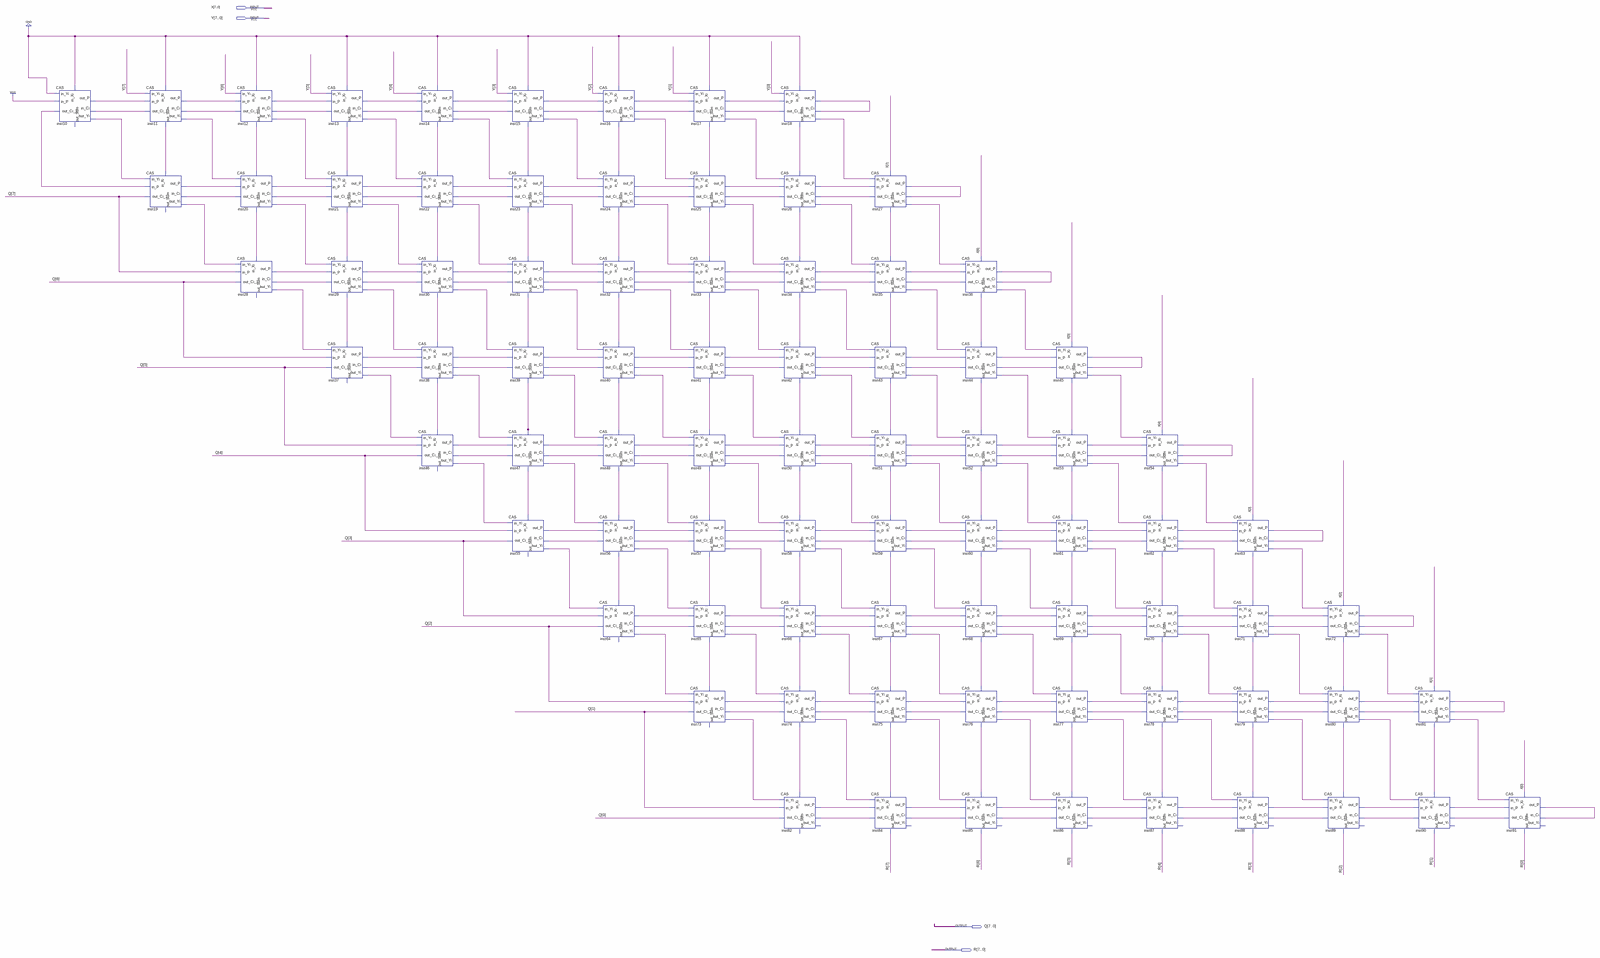
[diagram p0: schematic sheet, whole]
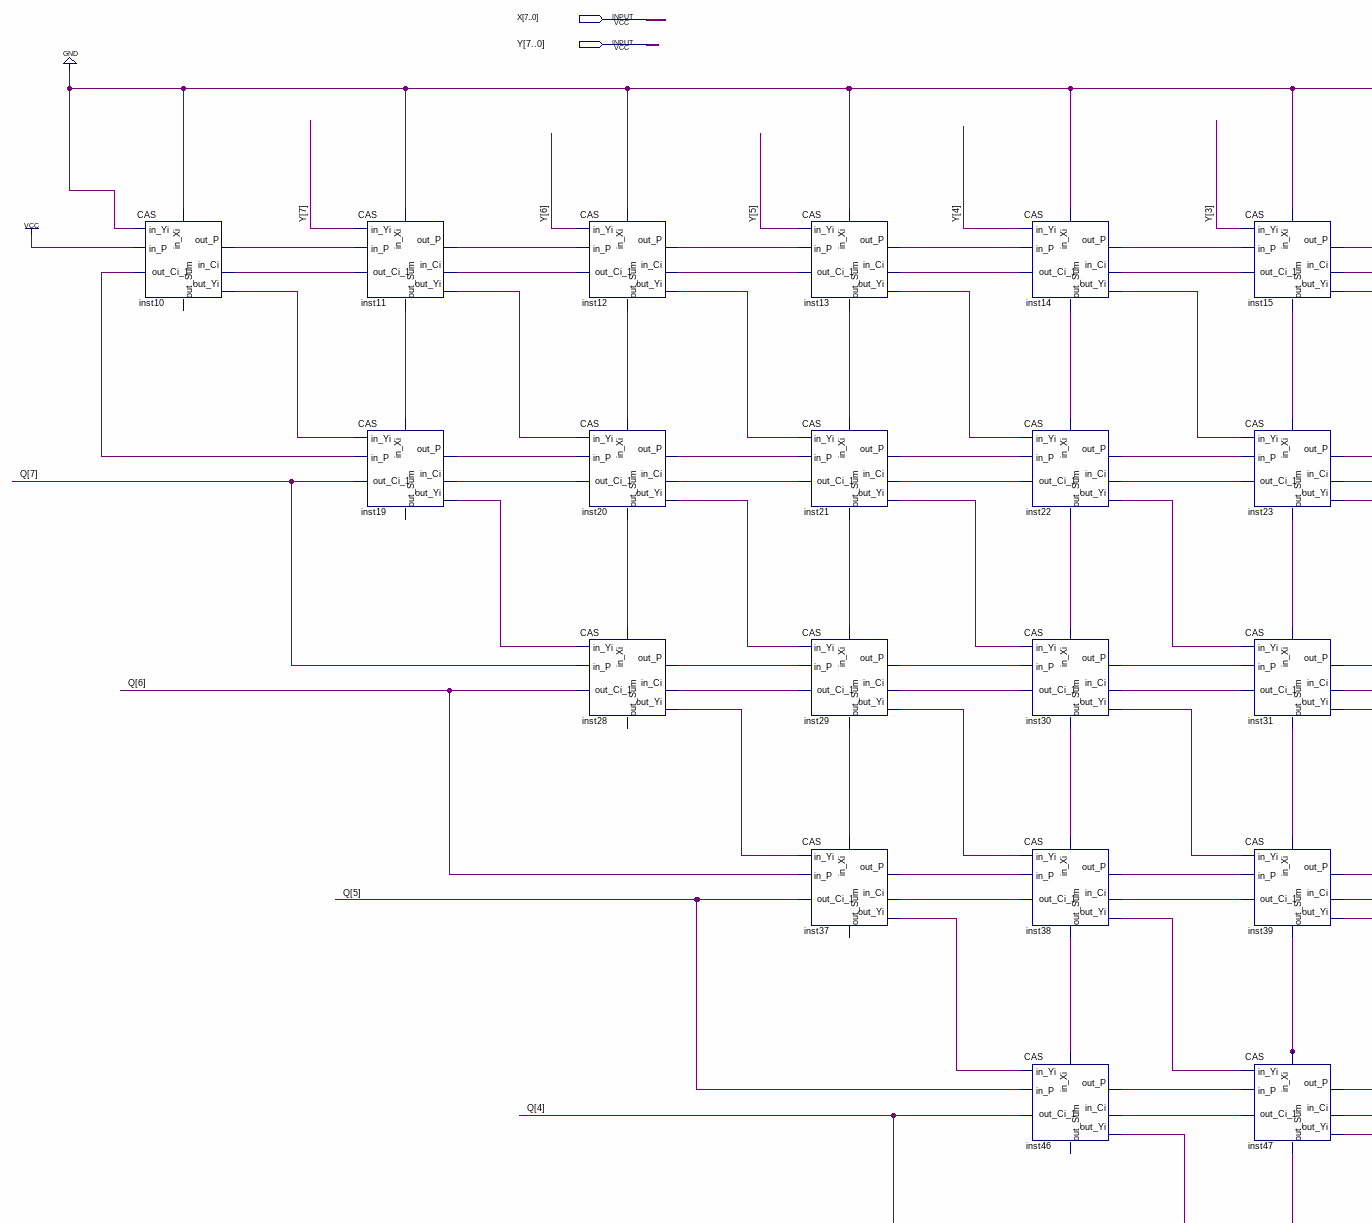
[diagram p1: schematic sheet, upper left part]
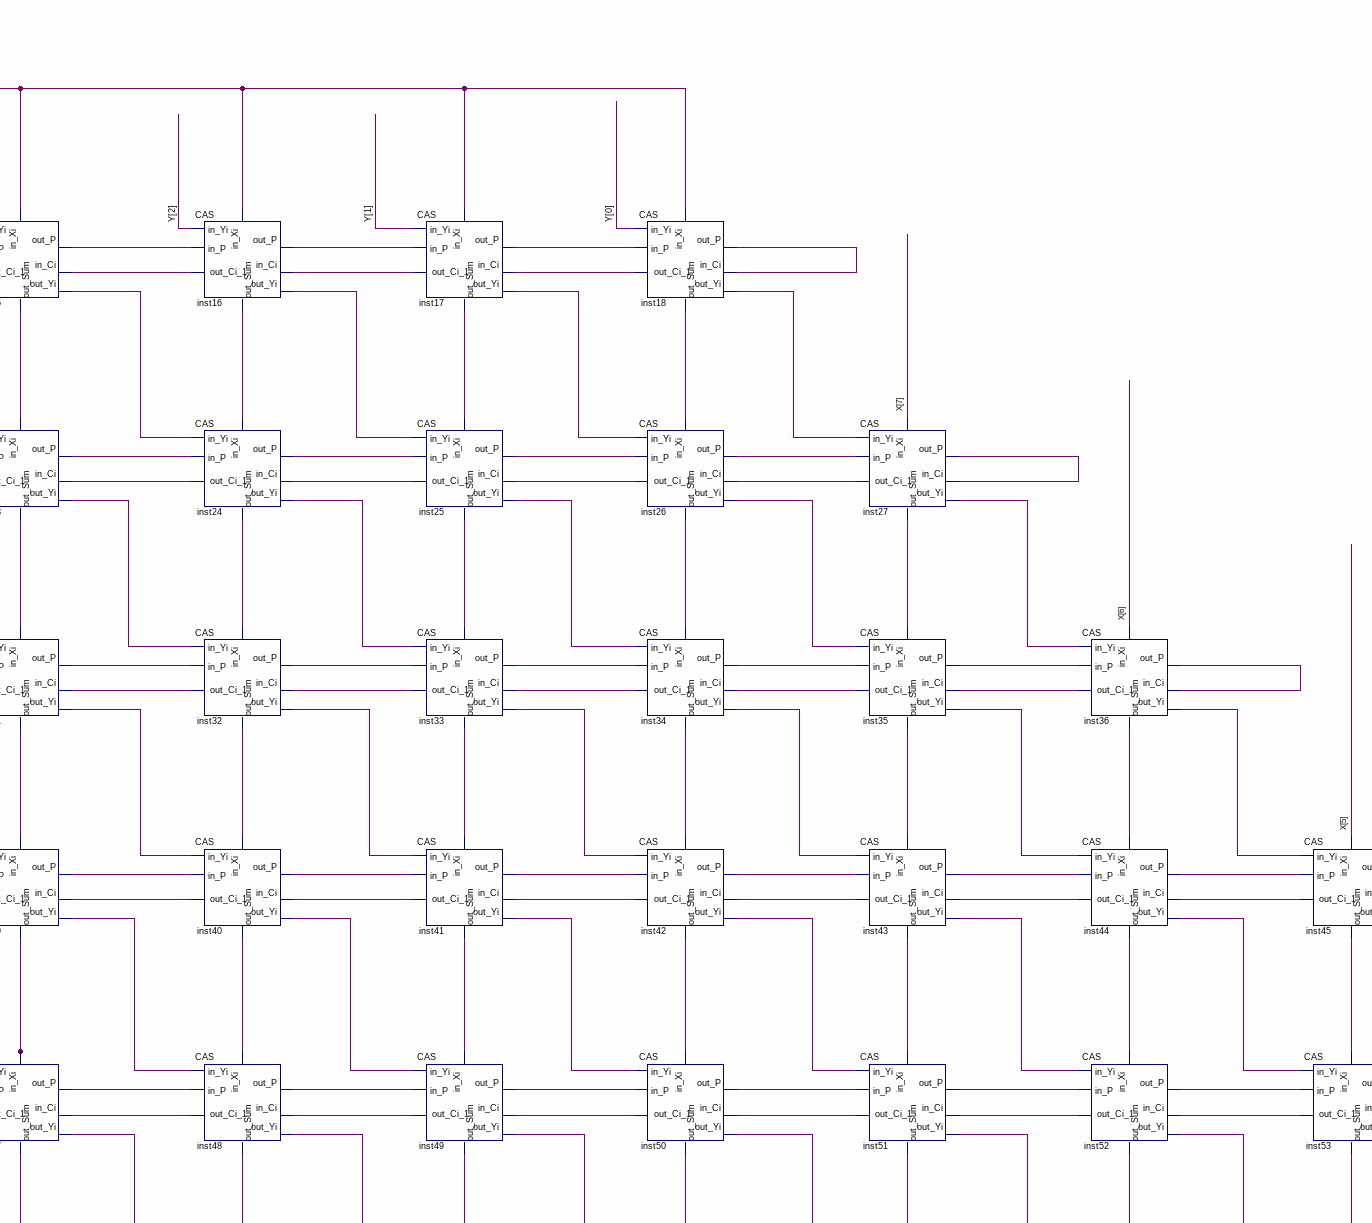
[diagram p2: schematic sheet, upper centre part]
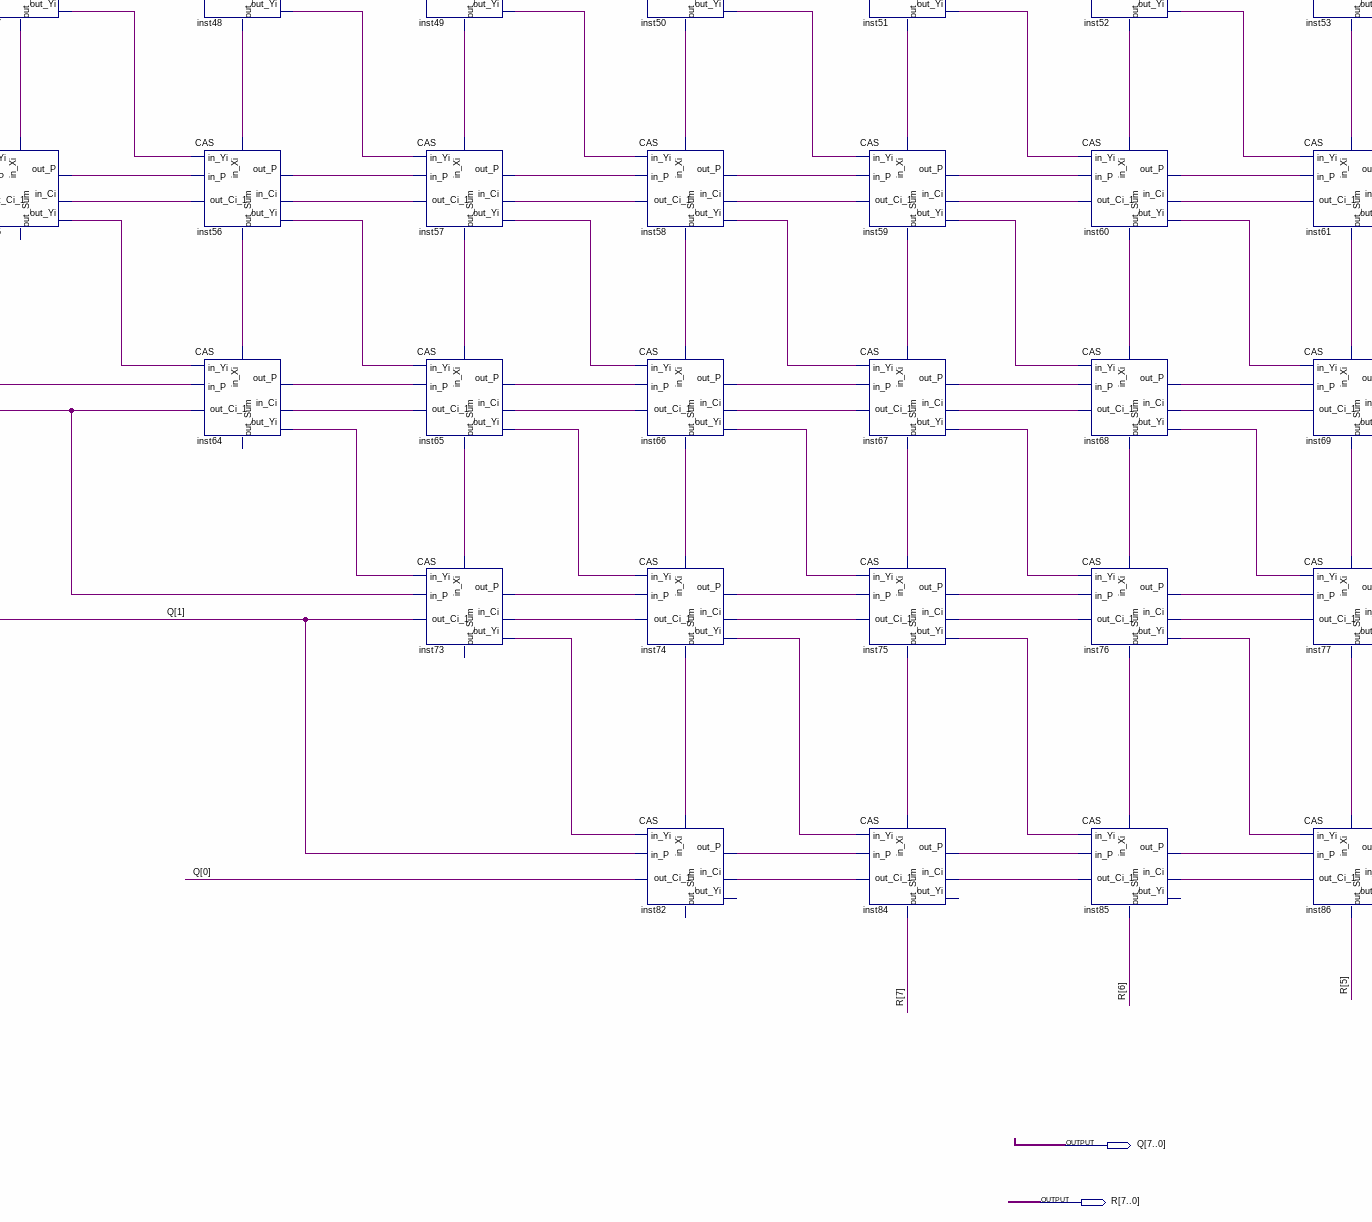
[diagram p3: schematic sheet, lower centre part]
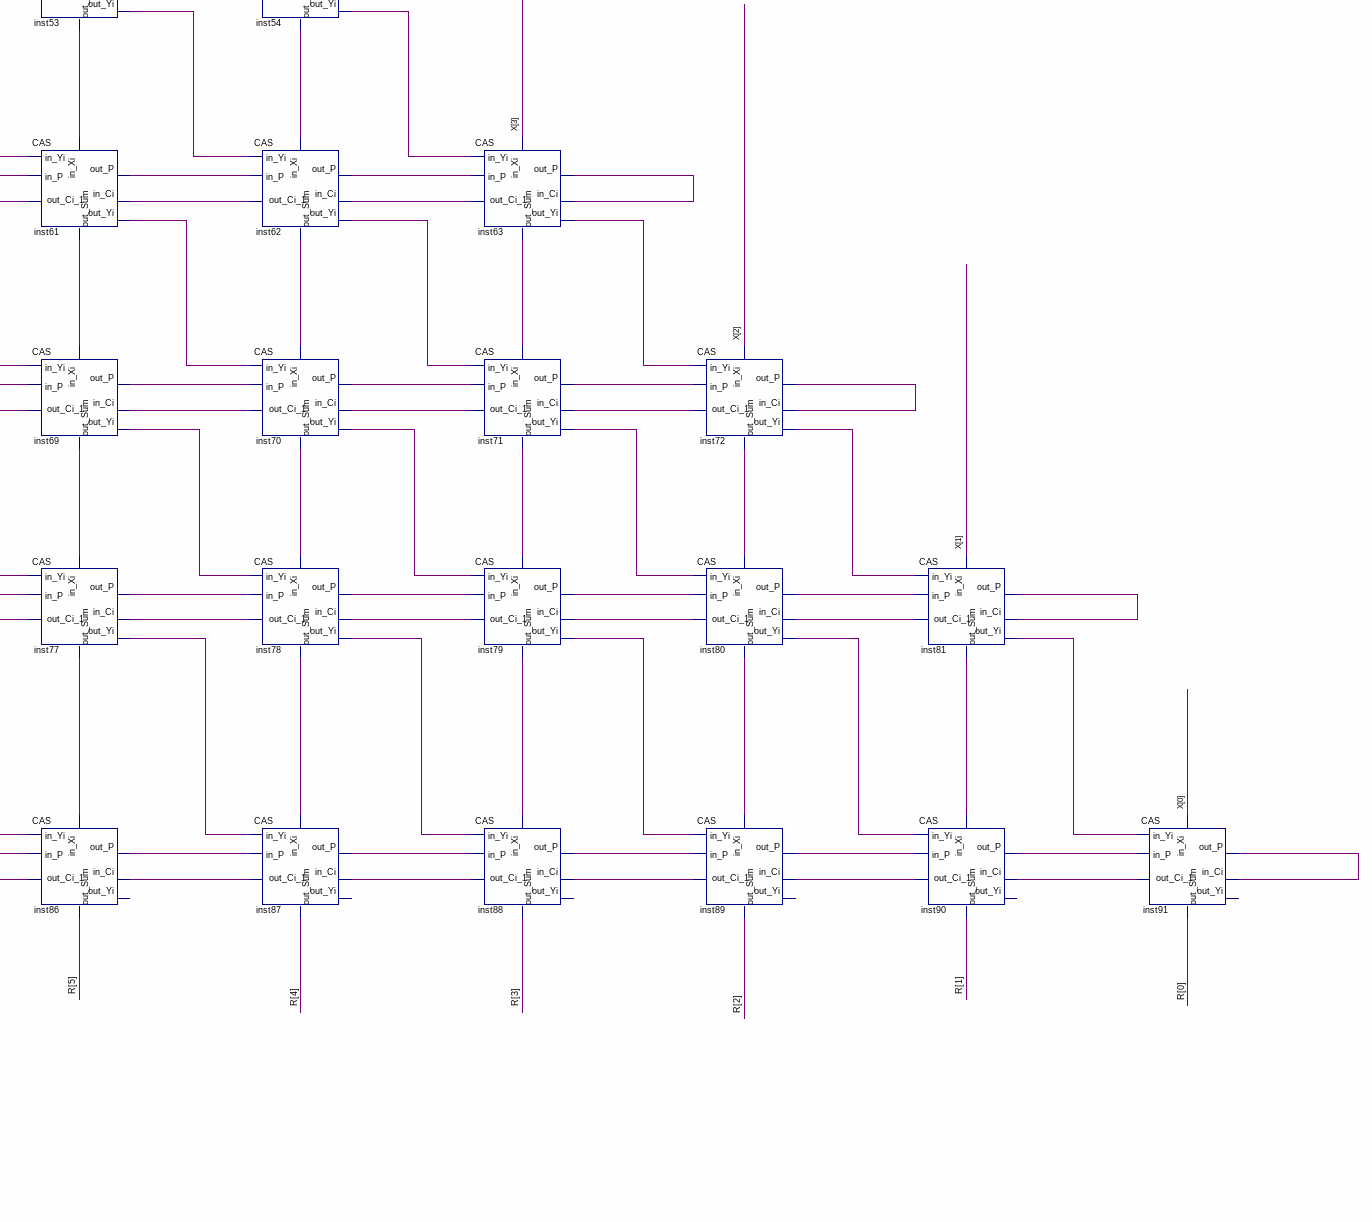
[diagram p4: schematic sheet, lower right part]
// Quartus schematic div8.bdf as structural Verilog: 81 symbols, 4 pins
module div8 (
  input  [7:0] X,
  input  [7:0] Y,
  output [7:0] Q,
  output [7:0] R
);

  wire inst10_out_ci_1, inst10_out_p, inst10_out_yi, inst11_out_ci_1, inst11_out_p, inst11_out_sum,
       inst11_out_yi, inst12_out_ci_1, inst12_out_p, inst12_out_sum, inst12_out_yi, inst13_out_ci_1,
       inst13_out_p, inst13_out_sum, inst13_out_yi, inst14_out_ci_1, inst14_out_p, inst14_out_sum,
       inst14_out_yi, inst15_out_ci_1, inst15_out_p, inst15_out_sum, inst15_out_yi, inst16_out_ci_1,
       inst16_out_p, inst16_out_sum, inst16_out_yi, inst17_out_ci_1, inst17_out_p, inst17_out_sum,
       inst17_out_yi, inst18_out_ci_1, inst18_out_p, inst18_out_sum, inst18_out_yi, inst19_out_p,
       inst19_out_yi, inst20_out_ci_1, inst20_out_p, inst20_out_sum, inst20_out_yi, inst21_out_ci_1,
       inst21_out_p, inst21_out_sum, inst21_out_yi, inst22_out_ci_1, inst22_out_p, inst22_out_sum,
       inst22_out_yi, inst23_out_ci_1, inst23_out_p, inst23_out_sum, inst23_out_yi, inst24_out_ci_1,
       inst24_out_p, inst24_out_sum, inst24_out_yi, inst25_out_ci_1, inst25_out_p, inst25_out_sum,
       inst25_out_yi, inst26_out_ci_1, inst26_out_p, inst26_out_sum, inst26_out_yi, inst27_out_ci_1,
       inst27_out_p, inst27_out_sum, inst27_out_yi, inst28_out_p, inst28_out_yi, inst29_out_ci_1,
       inst29_out_p, inst29_out_sum, inst29_out_yi, inst30_out_ci_1, inst30_out_p, inst30_out_sum,
       inst30_out_yi, inst31_out_ci_1, inst31_out_p, inst31_out_sum, inst31_out_yi, inst32_out_ci_1,
       inst32_out_p, inst32_out_sum, inst32_out_yi, inst33_out_ci_1, inst33_out_p, inst33_out_sum,
       inst33_out_yi, inst34_out_ci_1, inst34_out_p, inst34_out_sum, inst34_out_yi, inst35_out_ci_1,
       inst35_out_p, inst35_out_sum, inst35_out_yi, inst36_out_ci_1, inst36_out_p, inst36_out_sum,
       inst36_out_yi, inst37_out_p, inst37_out_yi, inst38_out_ci_1, inst38_out_p, inst38_out_sum,
       inst38_out_yi, inst39_out_ci_1, inst39_out_p, inst39_out_sum, inst39_out_yi, inst40_out_ci_1,
       inst40_out_p, inst40_out_sum, inst40_out_yi, inst41_out_ci_1, inst41_out_p, inst41_out_sum,
       inst41_out_yi, inst42_out_ci_1, inst42_out_p, inst42_out_sum, inst42_out_yi, inst43_out_ci_1,
       inst43_out_p, inst43_out_sum, inst43_out_yi, inst44_out_ci_1, inst44_out_p, inst44_out_sum,
       inst44_out_yi, inst45_out_ci_1, inst45_out_p, inst45_out_sum, inst45_out_yi, inst46_out_p,
       inst46_out_yi, inst47_out_ci_1, inst47_out_p, inst47_out_sum, inst47_out_yi, inst48_out_ci_1,
       inst48_out_p, inst48_out_sum, inst48_out_yi, inst49_out_ci_1, inst49_out_p, inst49_out_sum,
       inst49_out_yi, inst50_out_ci_1, inst50_out_p, inst50_out_sum, inst50_out_yi, inst51_out_ci_1,
       inst51_out_p, inst51_out_sum, inst51_out_yi, inst52_out_ci_1, inst52_out_p, inst52_out_sum,
       inst52_out_yi, inst53_out_ci_1, inst53_out_p, inst53_out_sum, inst53_out_yi, inst54_out_ci_1,
       inst54_out_p, inst54_out_sum, inst54_out_yi, inst55_out_p, inst55_out_yi, inst56_out_ci_1,
       inst56_out_p, inst56_out_sum, inst56_out_yi, inst57_out_ci_1, inst57_out_p, inst57_out_sum,
       inst57_out_yi, inst58_out_ci_1, inst58_out_p, inst58_out_sum, inst58_out_yi, inst59_out_ci_1,
       inst59_out_p, inst59_out_sum, inst59_out_yi, inst60_out_ci_1, inst60_out_p, inst60_out_sum,
       inst60_out_yi, inst61_out_ci_1, inst61_out_p, inst61_out_sum, inst61_out_yi, inst62_out_ci_1,
       inst62_out_p, inst62_out_sum, inst62_out_yi, inst63_out_ci_1, inst63_out_p, inst63_out_sum,
       inst63_out_yi, inst64_out_p, inst64_out_yi, inst65_out_ci_1, inst65_out_p, inst65_out_sum,
       inst65_out_yi, inst66_out_ci_1, inst66_out_p, inst66_out_sum, inst66_out_yi, inst67_out_ci_1,
       inst67_out_p, inst67_out_sum, inst67_out_yi, inst68_out_ci_1, inst68_out_p, inst68_out_sum,
       inst68_out_yi, inst69_out_ci_1, inst69_out_p, inst69_out_sum, inst69_out_yi, inst70_out_ci_1,
       inst70_out_p, inst70_out_sum, inst70_out_yi, inst71_out_ci_1, inst71_out_p, inst71_out_sum,
       inst71_out_yi, inst72_out_ci_1, inst72_out_p, inst72_out_sum, inst72_out_yi, inst73_out_p,
       inst73_out_yi, inst74_out_ci_1, inst74_out_p, inst74_out_sum, inst74_out_yi, inst75_out_ci_1,
       inst75_out_p, inst75_out_sum, inst75_out_yi, inst76_out_ci_1, inst76_out_p, inst76_out_sum,
       inst76_out_yi, inst77_out_ci_1, inst77_out_p, inst77_out_sum, inst77_out_yi, inst78_out_ci_1,
       inst78_out_p, inst78_out_sum, inst78_out_yi, inst79_out_ci_1, inst79_out_p, inst79_out_sum,
       inst79_out_yi, inst80_out_ci_1, inst80_out_p, inst80_out_sum, inst80_out_yi, inst81_out_ci_1,
       inst81_out_p, inst81_out_sum, inst81_out_yi, inst82_out_p, inst84_out_ci_1, inst84_out_p,
       inst85_out_ci_1, inst85_out_p, inst86_out_ci_1, inst86_out_p, inst87_out_ci_1, inst87_out_p,
       inst88_out_ci_1, inst88_out_p, inst89_out_ci_1, inst89_out_p, inst90_out_ci_1, inst90_out_p,
       inst91_out_ci_1, inst91_out_p;

  CAS inst10 (
    .in_Xi(1'b0), .in_Yi(1'b0), .in_P(1'b1), .in_Ci(inst11_out_ci_1), .out_P(inst10_out_p),
    .out_Yi(inst10_out_yi), .out_Ci_1(inst10_out_ci_1));  // open: out_Sum
  CAS inst11 (
    .in_Xi(1'b0), .in_Yi(Y[7]), .in_P(inst10_out_p), .in_Ci(inst12_out_ci_1), .out_P(inst11_out_p),
    .out_Yi(inst11_out_yi), .out_Sum(inst11_out_sum), .out_Ci_1(inst11_out_ci_1));
  CAS inst19 (
    .in_Xi(inst11_out_sum), .in_Yi(inst10_out_yi), .in_P(inst10_out_ci_1), .in_Ci(inst20_out_ci_1),
    .out_P(inst19_out_p), .out_Yi(inst19_out_yi), .out_Ci_1(Q[7]));  // open: out_Sum
  CAS inst12 (
    .in_Xi(1'b0), .in_Yi(Y[6]), .in_P(inst11_out_p), .in_Ci(inst13_out_ci_1), .out_P(inst12_out_p),
    .out_Yi(inst12_out_yi), .out_Sum(inst12_out_sum), .out_Ci_1(inst12_out_ci_1));
  CAS inst20 (
    .in_Xi(inst12_out_sum), .in_Yi(inst11_out_yi), .in_P(inst19_out_p), .in_Ci(inst21_out_ci_1),
    .out_P(inst20_out_p), .out_Yi(inst20_out_yi), .out_Sum(inst20_out_sum), .out_Ci_1(inst20_out_ci_1));
  CAS inst28 (
    .in_Xi(inst20_out_sum), .in_Yi(inst19_out_yi), .in_P(Q[7]), .in_Ci(inst29_out_ci_1),
    .out_P(inst28_out_p), .out_Yi(inst28_out_yi), .out_Ci_1(Q[6]));  // open: out_Sum
  CAS inst13 (
    .in_Xi(1'b0), .in_Yi(Y[5]), .in_P(inst12_out_p), .in_Ci(inst14_out_ci_1), .out_P(inst13_out_p),
    .out_Yi(inst13_out_yi), .out_Sum(inst13_out_sum), .out_Ci_1(inst13_out_ci_1));
  CAS inst21 (
    .in_Xi(inst13_out_sum), .in_Yi(inst12_out_yi), .in_P(inst20_out_p), .in_Ci(inst22_out_ci_1),
    .out_P(inst21_out_p), .out_Yi(inst21_out_yi), .out_Sum(inst21_out_sum), .out_Ci_1(inst21_out_ci_1));
  CAS inst29 (
    .in_Xi(inst21_out_sum), .in_Yi(inst20_out_yi), .in_P(inst28_out_p), .in_Ci(inst30_out_ci_1),
    .out_P(inst29_out_p), .out_Yi(inst29_out_yi), .out_Sum(inst29_out_sum), .out_Ci_1(inst29_out_ci_1));
  CAS inst37 (
    .in_Xi(inst29_out_sum), .in_Yi(inst28_out_yi), .in_P(Q[6]), .in_Ci(inst38_out_ci_1),
    .out_P(inst37_out_p), .out_Yi(inst37_out_yi), .out_Ci_1(Q[5]));  // open: out_Sum
  CAS inst14 (
    .in_Xi(1'b0), .in_Yi(Y[4]), .in_P(inst13_out_p), .in_Ci(inst15_out_ci_1), .out_P(inst14_out_p),
    .out_Yi(inst14_out_yi), .out_Sum(inst14_out_sum), .out_Ci_1(inst14_out_ci_1));
  CAS inst22 (
    .in_Xi(inst14_out_sum), .in_Yi(inst13_out_yi), .in_P(inst21_out_p), .in_Ci(inst23_out_ci_1),
    .out_P(inst22_out_p), .out_Yi(inst22_out_yi), .out_Sum(inst22_out_sum), .out_Ci_1(inst22_out_ci_1));
  CAS inst30 (
    .in_Xi(inst22_out_sum), .in_Yi(inst21_out_yi), .in_P(inst29_out_p), .in_Ci(inst31_out_ci_1),
    .out_P(inst30_out_p), .out_Yi(inst30_out_yi), .out_Sum(inst30_out_sum), .out_Ci_1(inst30_out_ci_1));
  CAS inst38 (
    .in_Xi(inst30_out_sum), .in_Yi(inst29_out_yi), .in_P(inst37_out_p), .in_Ci(inst39_out_ci_1),
    .out_P(inst38_out_p), .out_Yi(inst38_out_yi), .out_Sum(inst38_out_sum), .out_Ci_1(inst38_out_ci_1));
  CAS inst46 (
    .in_Xi(inst38_out_sum), .in_Yi(inst37_out_yi), .in_P(Q[5]), .in_Ci(inst47_out_ci_1),
    .out_P(inst46_out_p), .out_Yi(inst46_out_yi), .out_Ci_1(Q[4]));  // open: out_Sum
  CAS inst15 (
    .in_Xi(1'b0), .in_Yi(Y[3]), .in_P(inst14_out_p), .in_Ci(inst16_out_ci_1), .out_P(inst15_out_p),
    .out_Yi(inst15_out_yi), .out_Sum(inst15_out_sum), .out_Ci_1(inst15_out_ci_1));
  CAS inst23 (
    .in_Xi(inst15_out_sum), .in_Yi(inst14_out_yi), .in_P(inst22_out_p), .in_Ci(inst24_out_ci_1),
    .out_P(inst23_out_p), .out_Yi(inst23_out_yi), .out_Sum(inst23_out_sum), .out_Ci_1(inst23_out_ci_1));
  CAS inst31 (
    .in_Xi(inst23_out_sum), .in_Yi(inst22_out_yi), .in_P(inst30_out_p), .in_Ci(inst32_out_ci_1),
    .out_P(inst31_out_p), .out_Yi(inst31_out_yi), .out_Sum(inst31_out_sum), .out_Ci_1(inst31_out_ci_1));
  CAS inst39 (
    .in_Xi(inst31_out_sum), .in_Yi(inst30_out_yi), .in_P(inst38_out_p), .in_Ci(inst40_out_ci_1),
    .out_P(inst39_out_p), .out_Yi(inst39_out_yi), .out_Sum(inst39_out_sum), .out_Ci_1(inst39_out_ci_1));
  CAS inst47 (
    .in_Xi(inst39_out_sum), .in_Yi(inst38_out_yi), .in_P(inst46_out_p), .in_Ci(inst48_out_ci_1),
    .out_P(inst47_out_p), .out_Yi(inst47_out_yi), .out_Sum(inst47_out_sum), .out_Ci_1(inst47_out_ci_1));
  CAS inst55 (
    .in_Xi(inst47_out_sum), .in_Yi(inst46_out_yi), .in_P(Q[4]), .in_Ci(inst56_out_ci_1),
    .out_P(inst55_out_p), .out_Yi(inst55_out_yi), .out_Ci_1(Q[3]));  // open: out_Sum
  CAS inst16 (
    .in_Xi(1'b0), .in_Yi(Y[2]), .in_P(inst15_out_p), .in_Ci(inst17_out_ci_1), .out_P(inst16_out_p),
    .out_Yi(inst16_out_yi), .out_Sum(inst16_out_sum), .out_Ci_1(inst16_out_ci_1));
  CAS inst24 (
    .in_Xi(inst16_out_sum), .in_Yi(inst15_out_yi), .in_P(inst23_out_p), .in_Ci(inst25_out_ci_1),
    .out_P(inst24_out_p), .out_Yi(inst24_out_yi), .out_Sum(inst24_out_sum), .out_Ci_1(inst24_out_ci_1));
  CAS inst32 (
    .in_Xi(inst24_out_sum), .in_Yi(inst23_out_yi), .in_P(inst31_out_p), .in_Ci(inst33_out_ci_1),
    .out_P(inst32_out_p), .out_Yi(inst32_out_yi), .out_Sum(inst32_out_sum), .out_Ci_1(inst32_out_ci_1));
  CAS inst40 (
    .in_Xi(inst32_out_sum), .in_Yi(inst31_out_yi), .in_P(inst39_out_p), .in_Ci(inst41_out_ci_1),
    .out_P(inst40_out_p), .out_Yi(inst40_out_yi), .out_Sum(inst40_out_sum), .out_Ci_1(inst40_out_ci_1));
  CAS inst48 (
    .in_Xi(inst40_out_sum), .in_Yi(inst39_out_yi), .in_P(inst47_out_p), .in_Ci(inst49_out_ci_1),
    .out_P(inst48_out_p), .out_Yi(inst48_out_yi), .out_Sum(inst48_out_sum), .out_Ci_1(inst48_out_ci_1));
  CAS inst56 (
    .in_Xi(inst48_out_sum), .in_Yi(inst47_out_yi), .in_P(inst55_out_p), .in_Ci(inst57_out_ci_1),
    .out_P(inst56_out_p), .out_Yi(inst56_out_yi), .out_Sum(inst56_out_sum), .out_Ci_1(inst56_out_ci_1));
  CAS inst64 (
    .in_Xi(inst56_out_sum), .in_Yi(inst55_out_yi), .in_P(Q[3]), .in_Ci(inst65_out_ci_1),
    .out_P(inst64_out_p), .out_Yi(inst64_out_yi), .out_Ci_1(Q[2]));  // open: out_Sum
  CAS inst17 (
    .in_Xi(1'b0), .in_Yi(Y[1]), .in_P(inst16_out_p), .in_Ci(inst18_out_ci_1), .out_P(inst17_out_p),
    .out_Yi(inst17_out_yi), .out_Sum(inst17_out_sum), .out_Ci_1(inst17_out_ci_1));
  CAS inst25 (
    .in_Xi(inst17_out_sum), .in_Yi(inst16_out_yi), .in_P(inst24_out_p), .in_Ci(inst26_out_ci_1),
    .out_P(inst25_out_p), .out_Yi(inst25_out_yi), .out_Sum(inst25_out_sum), .out_Ci_1(inst25_out_ci_1));
  CAS inst33 (
    .in_Xi(inst25_out_sum), .in_Yi(inst24_out_yi), .in_P(inst32_out_p), .in_Ci(inst34_out_ci_1),
    .out_P(inst33_out_p), .out_Yi(inst33_out_yi), .out_Sum(inst33_out_sum), .out_Ci_1(inst33_out_ci_1));
  CAS inst41 (
    .in_Xi(inst33_out_sum), .in_Yi(inst32_out_yi), .in_P(inst40_out_p), .in_Ci(inst42_out_ci_1),
    .out_P(inst41_out_p), .out_Yi(inst41_out_yi), .out_Sum(inst41_out_sum), .out_Ci_1(inst41_out_ci_1));
  CAS inst49 (
    .in_Xi(inst41_out_sum), .in_Yi(inst40_out_yi), .in_P(inst48_out_p), .in_Ci(inst50_out_ci_1),
    .out_P(inst49_out_p), .out_Yi(inst49_out_yi), .out_Sum(inst49_out_sum), .out_Ci_1(inst49_out_ci_1));
  CAS inst57 (
    .in_Xi(inst49_out_sum), .in_Yi(inst48_out_yi), .in_P(inst56_out_p), .in_Ci(inst58_out_ci_1),
    .out_P(inst57_out_p), .out_Yi(inst57_out_yi), .out_Sum(inst57_out_sum), .out_Ci_1(inst57_out_ci_1));
  CAS inst65 (
    .in_Xi(inst57_out_sum), .in_Yi(inst56_out_yi), .in_P(inst64_out_p), .in_Ci(inst66_out_ci_1),
    .out_P(inst65_out_p), .out_Yi(inst65_out_yi), .out_Sum(inst65_out_sum), .out_Ci_1(inst65_out_ci_1));
  CAS inst73 (
    .in_Xi(inst65_out_sum), .in_Yi(inst64_out_yi), .in_P(Q[2]), .in_Ci(inst74_out_ci_1),
    .out_P(inst73_out_p), .out_Yi(inst73_out_yi), .out_Ci_1(Q[1]));  // open: out_Sum
  CAS inst18 (
    .in_Xi(1'b0), .in_Yi(Y[0]), .in_P(inst17_out_p), .in_Ci(inst18_out_p), .out_P(inst18_out_p),
    .out_Yi(inst18_out_yi), .out_Sum(inst18_out_sum), .out_Ci_1(inst18_out_ci_1));
  CAS inst26 (
    .in_Xi(inst18_out_sum), .in_Yi(inst17_out_yi), .in_P(inst25_out_p), .in_Ci(inst27_out_ci_1),
    .out_P(inst26_out_p), .out_Yi(inst26_out_yi), .out_Sum(inst26_out_sum), .out_Ci_1(inst26_out_ci_1));
  CAS inst34 (
    .in_Xi(inst26_out_sum), .in_Yi(inst25_out_yi), .in_P(inst33_out_p), .in_Ci(inst35_out_ci_1),
    .out_P(inst34_out_p), .out_Yi(inst34_out_yi), .out_Sum(inst34_out_sum), .out_Ci_1(inst34_out_ci_1));
  CAS inst42 (
    .in_Xi(inst34_out_sum), .in_Yi(inst33_out_yi), .in_P(inst41_out_p), .in_Ci(inst43_out_ci_1),
    .out_P(inst42_out_p), .out_Yi(inst42_out_yi), .out_Sum(inst42_out_sum), .out_Ci_1(inst42_out_ci_1));
  CAS inst50 (
    .in_Xi(inst42_out_sum), .in_Yi(inst41_out_yi), .in_P(inst49_out_p), .in_Ci(inst51_out_ci_1),
    .out_P(inst50_out_p), .out_Yi(inst50_out_yi), .out_Sum(inst50_out_sum), .out_Ci_1(inst50_out_ci_1));
  CAS inst58 (
    .in_Xi(inst50_out_sum), .in_Yi(inst49_out_yi), .in_P(inst57_out_p), .in_Ci(inst59_out_ci_1),
    .out_P(inst58_out_p), .out_Yi(inst58_out_yi), .out_Sum(inst58_out_sum), .out_Ci_1(inst58_out_ci_1));
  CAS inst66 (
    .in_Xi(inst58_out_sum), .in_Yi(inst57_out_yi), .in_P(inst65_out_p), .in_Ci(inst67_out_ci_1),
    .out_P(inst66_out_p), .out_Yi(inst66_out_yi), .out_Sum(inst66_out_sum), .out_Ci_1(inst66_out_ci_1));
  CAS inst74 (
    .in_Xi(inst66_out_sum), .in_Yi(inst65_out_yi), .in_P(inst73_out_p), .in_Ci(inst75_out_ci_1),
    .out_P(inst74_out_p), .out_Yi(inst74_out_yi), .out_Sum(inst74_out_sum), .out_Ci_1(inst74_out_ci_1));
  CAS inst82 (
    .in_Xi(inst74_out_sum), .in_Yi(inst73_out_yi), .in_P(Q[1]), .in_Ci(inst84_out_ci_1),
    .out_P(inst82_out_p), .out_Ci_1(Q[0]));  // open: out_Yi, out_Sum
  CAS inst27 (
    .in_Xi(X[7]), .in_Yi(inst18_out_yi), .in_P(inst26_out_p), .in_Ci(inst27_out_p), .out_P(inst27_out_p),
    .out_Yi(inst27_out_yi), .out_Sum(inst27_out_sum), .out_Ci_1(inst27_out_ci_1));
  CAS inst35 (
    .in_Xi(inst27_out_sum), .in_Yi(inst26_out_yi), .in_P(inst34_out_p), .in_Ci(inst36_out_ci_1),
    .out_P(inst35_out_p), .out_Yi(inst35_out_yi), .out_Sum(inst35_out_sum), .out_Ci_1(inst35_out_ci_1));
  CAS inst43 (
    .in_Xi(inst35_out_sum), .in_Yi(inst34_out_yi), .in_P(inst42_out_p), .in_Ci(inst44_out_ci_1),
    .out_P(inst43_out_p), .out_Yi(inst43_out_yi), .out_Sum(inst43_out_sum), .out_Ci_1(inst43_out_ci_1));
  CAS inst51 (
    .in_Xi(inst43_out_sum), .in_Yi(inst42_out_yi), .in_P(inst50_out_p), .in_Ci(inst52_out_ci_1),
    .out_P(inst51_out_p), .out_Yi(inst51_out_yi), .out_Sum(inst51_out_sum), .out_Ci_1(inst51_out_ci_1));
  CAS inst59 (
    .in_Xi(inst51_out_sum), .in_Yi(inst50_out_yi), .in_P(inst58_out_p), .in_Ci(inst60_out_ci_1),
    .out_P(inst59_out_p), .out_Yi(inst59_out_yi), .out_Sum(inst59_out_sum), .out_Ci_1(inst59_out_ci_1));
  CAS inst67 (
    .in_Xi(inst59_out_sum), .in_Yi(inst58_out_yi), .in_P(inst66_out_p), .in_Ci(inst68_out_ci_1),
    .out_P(inst67_out_p), .out_Yi(inst67_out_yi), .out_Sum(inst67_out_sum), .out_Ci_1(inst67_out_ci_1));
  CAS inst75 (
    .in_Xi(inst67_out_sum), .in_Yi(inst66_out_yi), .in_P(inst74_out_p), .in_Ci(inst76_out_ci_1),
    .out_P(inst75_out_p), .out_Yi(inst75_out_yi), .out_Sum(inst75_out_sum), .out_Ci_1(inst75_out_ci_1));
  CAS inst84 (
    .in_Xi(inst75_out_sum), .in_Yi(inst74_out_yi), .in_P(inst82_out_p), .in_Ci(inst85_out_ci_1),
    .out_P(inst84_out_p), .out_Sum(R[7]), .out_Ci_1(inst84_out_ci_1));  // open: out_Yi
  CAS inst36 (
    .in_Xi(X[6]), .in_Yi(inst27_out_yi), .in_P(inst35_out_p), .in_Ci(inst36_out_p), .out_P(inst36_out_p),
    .out_Yi(inst36_out_yi), .out_Sum(inst36_out_sum), .out_Ci_1(inst36_out_ci_1));
  CAS inst44 (
    .in_Xi(inst36_out_sum), .in_Yi(inst35_out_yi), .in_P(inst43_out_p), .in_Ci(inst45_out_ci_1),
    .out_P(inst44_out_p), .out_Yi(inst44_out_yi), .out_Sum(inst44_out_sum), .out_Ci_1(inst44_out_ci_1));
  CAS inst52 (
    .in_Xi(inst44_out_sum), .in_Yi(inst43_out_yi), .in_P(inst51_out_p), .in_Ci(inst53_out_ci_1),
    .out_P(inst52_out_p), .out_Yi(inst52_out_yi), .out_Sum(inst52_out_sum), .out_Ci_1(inst52_out_ci_1));
  CAS inst60 (
    .in_Xi(inst52_out_sum), .in_Yi(inst51_out_yi), .in_P(inst59_out_p), .in_Ci(inst61_out_ci_1),
    .out_P(inst60_out_p), .out_Yi(inst60_out_yi), .out_Sum(inst60_out_sum), .out_Ci_1(inst60_out_ci_1));
  CAS inst68 (
    .in_Xi(inst60_out_sum), .in_Yi(inst59_out_yi), .in_P(inst67_out_p), .in_Ci(inst69_out_ci_1),
    .out_P(inst68_out_p), .out_Yi(inst68_out_yi), .out_Sum(inst68_out_sum), .out_Ci_1(inst68_out_ci_1));
  CAS inst76 (
    .in_Xi(inst68_out_sum), .in_Yi(inst67_out_yi), .in_P(inst75_out_p), .in_Ci(inst77_out_ci_1),
    .out_P(inst76_out_p), .out_Yi(inst76_out_yi), .out_Sum(inst76_out_sum), .out_Ci_1(inst76_out_ci_1));
  CAS inst85 (
    .in_Xi(inst76_out_sum), .in_Yi(inst75_out_yi), .in_P(inst84_out_p), .in_Ci(inst86_out_ci_1),
    .out_P(inst85_out_p), .out_Sum(R[6]), .out_Ci_1(inst85_out_ci_1));  // open: out_Yi
  CAS inst45 (
    .in_Xi(X[5]), .in_Yi(inst36_out_yi), .in_P(inst44_out_p), .in_Ci(inst45_out_p), .out_P(inst45_out_p),
    .out_Yi(inst45_out_yi), .out_Sum(inst45_out_sum), .out_Ci_1(inst45_out_ci_1));
  CAS inst53 (
    .in_Xi(inst45_out_sum), .in_Yi(inst44_out_yi), .in_P(inst52_out_p), .in_Ci(inst54_out_ci_1),
    .out_P(inst53_out_p), .out_Yi(inst53_out_yi), .out_Sum(inst53_out_sum), .out_Ci_1(inst53_out_ci_1));
  CAS inst61 (
    .in_Xi(inst53_out_sum), .in_Yi(inst52_out_yi), .in_P(inst60_out_p), .in_Ci(inst62_out_ci_1),
    .out_P(inst61_out_p), .out_Yi(inst61_out_yi), .out_Sum(inst61_out_sum), .out_Ci_1(inst61_out_ci_1));
  CAS inst69 (
    .in_Xi(inst61_out_sum), .in_Yi(inst60_out_yi), .in_P(inst68_out_p), .in_Ci(inst70_out_ci_1),
    .out_P(inst69_out_p), .out_Yi(inst69_out_yi), .out_Sum(inst69_out_sum), .out_Ci_1(inst69_out_ci_1));
  CAS inst77 (
    .in_Xi(inst69_out_sum), .in_Yi(inst68_out_yi), .in_P(inst76_out_p), .in_Ci(inst78_out_ci_1),
    .out_P(inst77_out_p), .out_Yi(inst77_out_yi), .out_Sum(inst77_out_sum), .out_Ci_1(inst77_out_ci_1));
  CAS inst86 (
    .in_Xi(inst77_out_sum), .in_Yi(inst76_out_yi), .in_P(inst85_out_p), .in_Ci(inst87_out_ci_1),
    .out_P(inst86_out_p), .out_Sum(R[5]), .out_Ci_1(inst86_out_ci_1));  // open: out_Yi
  CAS inst54 (
    .in_Xi(X[4]), .in_Yi(inst45_out_yi), .in_P(inst53_out_p), .in_Ci(inst54_out_p), .out_P(inst54_out_p),
    .out_Yi(inst54_out_yi), .out_Sum(inst54_out_sum), .out_Ci_1(inst54_out_ci_1));
  CAS inst62 (
    .in_Xi(inst54_out_sum), .in_Yi(inst53_out_yi), .in_P(inst61_out_p), .in_Ci(inst63_out_ci_1),
    .out_P(inst62_out_p), .out_Yi(inst62_out_yi), .out_Sum(inst62_out_sum), .out_Ci_1(inst62_out_ci_1));
  CAS inst70 (
    .in_Xi(inst62_out_sum), .in_Yi(inst61_out_yi), .in_P(inst69_out_p), .in_Ci(inst71_out_ci_1),
    .out_P(inst70_out_p), .out_Yi(inst70_out_yi), .out_Sum(inst70_out_sum), .out_Ci_1(inst70_out_ci_1));
  CAS inst78 (
    .in_Xi(inst70_out_sum), .in_Yi(inst69_out_yi), .in_P(inst77_out_p), .in_Ci(inst79_out_ci_1),
    .out_P(inst78_out_p), .out_Yi(inst78_out_yi), .out_Sum(inst78_out_sum), .out_Ci_1(inst78_out_ci_1));
  CAS inst87 (
    .in_Xi(inst78_out_sum), .in_Yi(inst77_out_yi), .in_P(inst86_out_p), .in_Ci(inst88_out_ci_1),
    .out_P(inst87_out_p), .out_Sum(R[4]), .out_Ci_1(inst87_out_ci_1));  // open: out_Yi
  CAS inst63 (
    .in_Xi(X[3]), .in_Yi(inst54_out_yi), .in_P(inst62_out_p), .in_Ci(inst63_out_p), .out_P(inst63_out_p),
    .out_Yi(inst63_out_yi), .out_Sum(inst63_out_sum), .out_Ci_1(inst63_out_ci_1));
  CAS inst71 (
    .in_Xi(inst63_out_sum), .in_Yi(inst62_out_yi), .in_P(inst70_out_p), .in_Ci(inst72_out_ci_1),
    .out_P(inst71_out_p), .out_Yi(inst71_out_yi), .out_Sum(inst71_out_sum), .out_Ci_1(inst71_out_ci_1));
  CAS inst79 (
    .in_Xi(inst71_out_sum), .in_Yi(inst70_out_yi), .in_P(inst78_out_p), .in_Ci(inst80_out_ci_1),
    .out_P(inst79_out_p), .out_Yi(inst79_out_yi), .out_Sum(inst79_out_sum), .out_Ci_1(inst79_out_ci_1));
  CAS inst88 (
    .in_Xi(inst79_out_sum), .in_Yi(inst78_out_yi), .in_P(inst87_out_p), .in_Ci(inst89_out_ci_1),
    .out_P(inst88_out_p), .out_Sum(R[3]), .out_Ci_1(inst88_out_ci_1));  // open: out_Yi
  CAS inst72 (
    .in_Xi(X[2]), .in_Yi(inst63_out_yi), .in_P(inst71_out_p), .in_Ci(inst72_out_p), .out_P(inst72_out_p),
    .out_Yi(inst72_out_yi), .out_Sum(inst72_out_sum), .out_Ci_1(inst72_out_ci_1));
  CAS inst80 (
    .in_Xi(inst72_out_sum), .in_Yi(inst71_out_yi), .in_P(inst79_out_p), .in_Ci(inst81_out_ci_1),
    .out_P(inst80_out_p), .out_Yi(inst80_out_yi), .out_Sum(inst80_out_sum), .out_Ci_1(inst80_out_ci_1));
  CAS inst89 (
    .in_Xi(inst80_out_sum), .in_Yi(inst79_out_yi), .in_P(inst88_out_p), .in_Ci(inst90_out_ci_1),
    .out_P(inst89_out_p), .out_Sum(R[2]), .out_Ci_1(inst89_out_ci_1));  // open: out_Yi
  CAS inst81 (
    .in_Xi(X[1]), .in_Yi(inst72_out_yi), .in_P(inst80_out_p), .in_Ci(inst81_out_p), .out_P(inst81_out_p),
    .out_Yi(inst81_out_yi), .out_Sum(inst81_out_sum), .out_Ci_1(inst81_out_ci_1));
  CAS inst90 (
    .in_Xi(inst81_out_sum), .in_Yi(inst80_out_yi), .in_P(inst89_out_p), .in_Ci(inst91_out_ci_1),
    .out_P(inst90_out_p), .out_Sum(R[1]), .out_Ci_1(inst90_out_ci_1));  // open: out_Yi
  CAS inst91 (
    .in_Xi(X[0]), .in_Yi(inst81_out_yi), .in_P(inst90_out_p), .in_Ci(inst91_out_p), .out_P(inst91_out_p),
    .out_Sum(R[0]), .out_Ci_1(inst91_out_ci_1));  // open: out_Yi
endmodule
